# EasyEDA schematic LcsNodes-Extension-Turnout-Servo-and-Relay-B.00.01.json

## Sheets
1 Sheet_1: TITLE: Sheet_1; REV: 1.0; Date: 2023-05-06; Sheet: 1/1; Drawn By: helmut-f; Company: Your Company
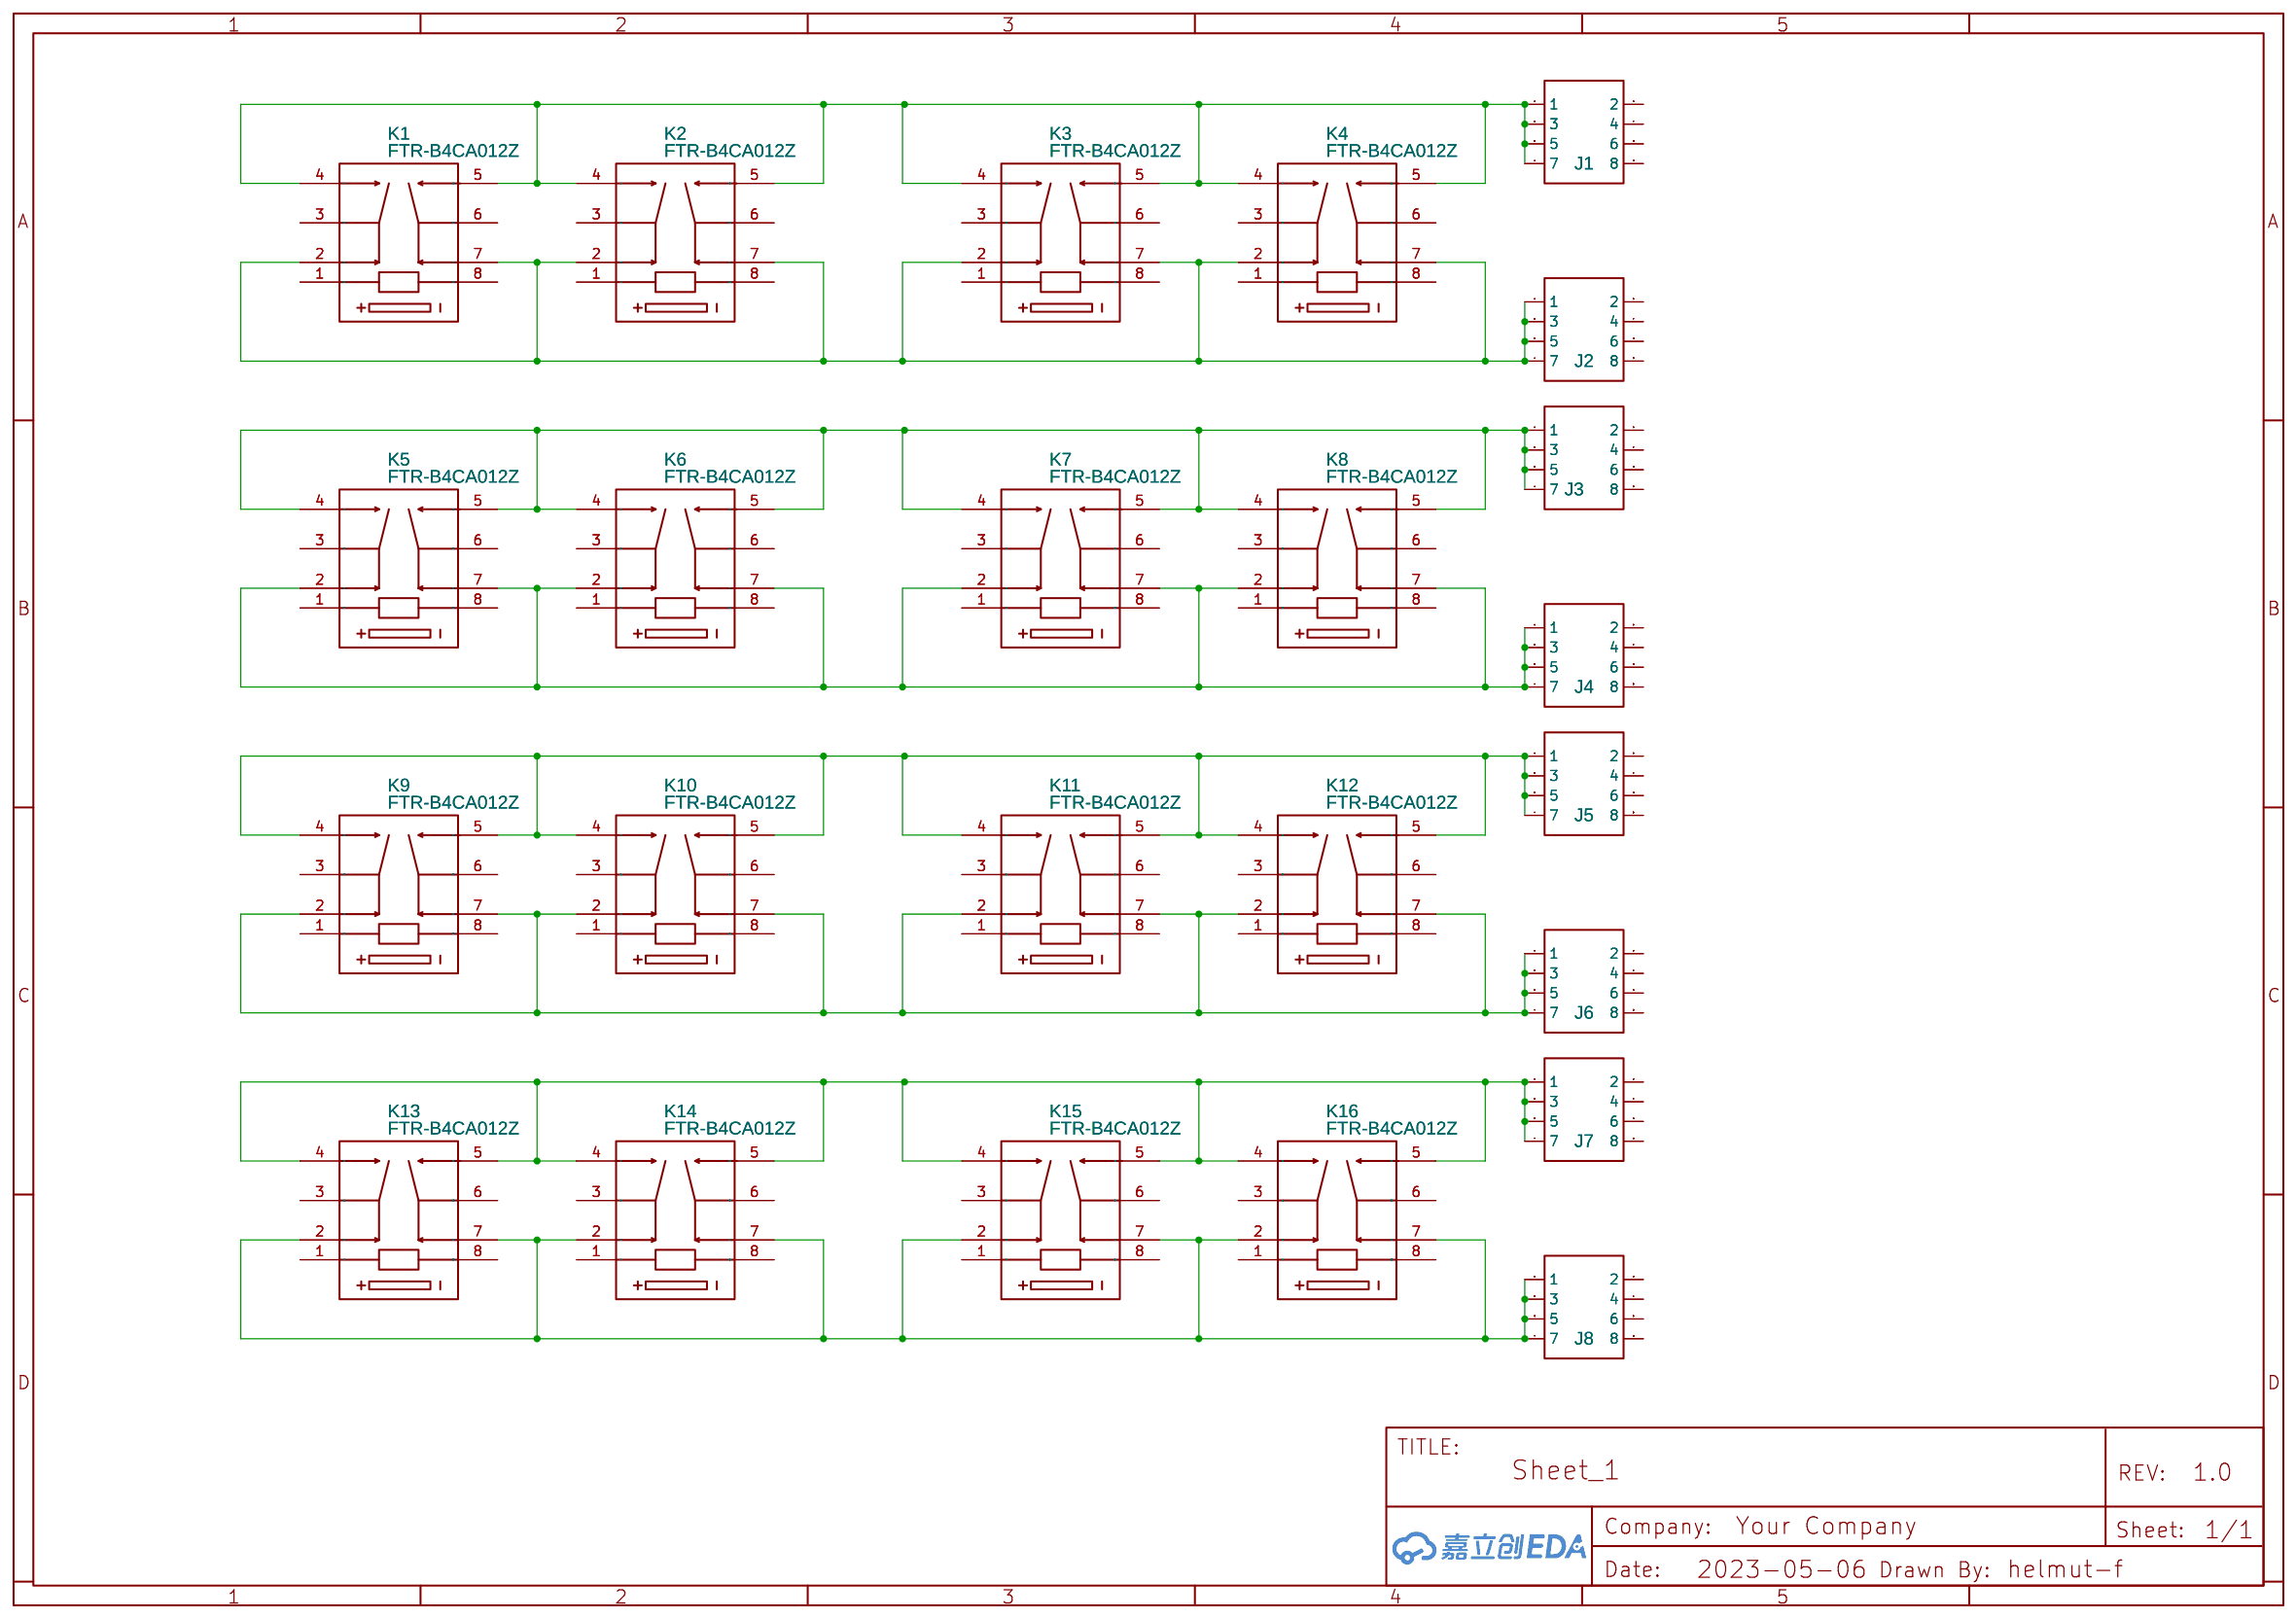
[diagram p0: Sheet_1]
2 Sheet_2: TITLE: Sheet_2
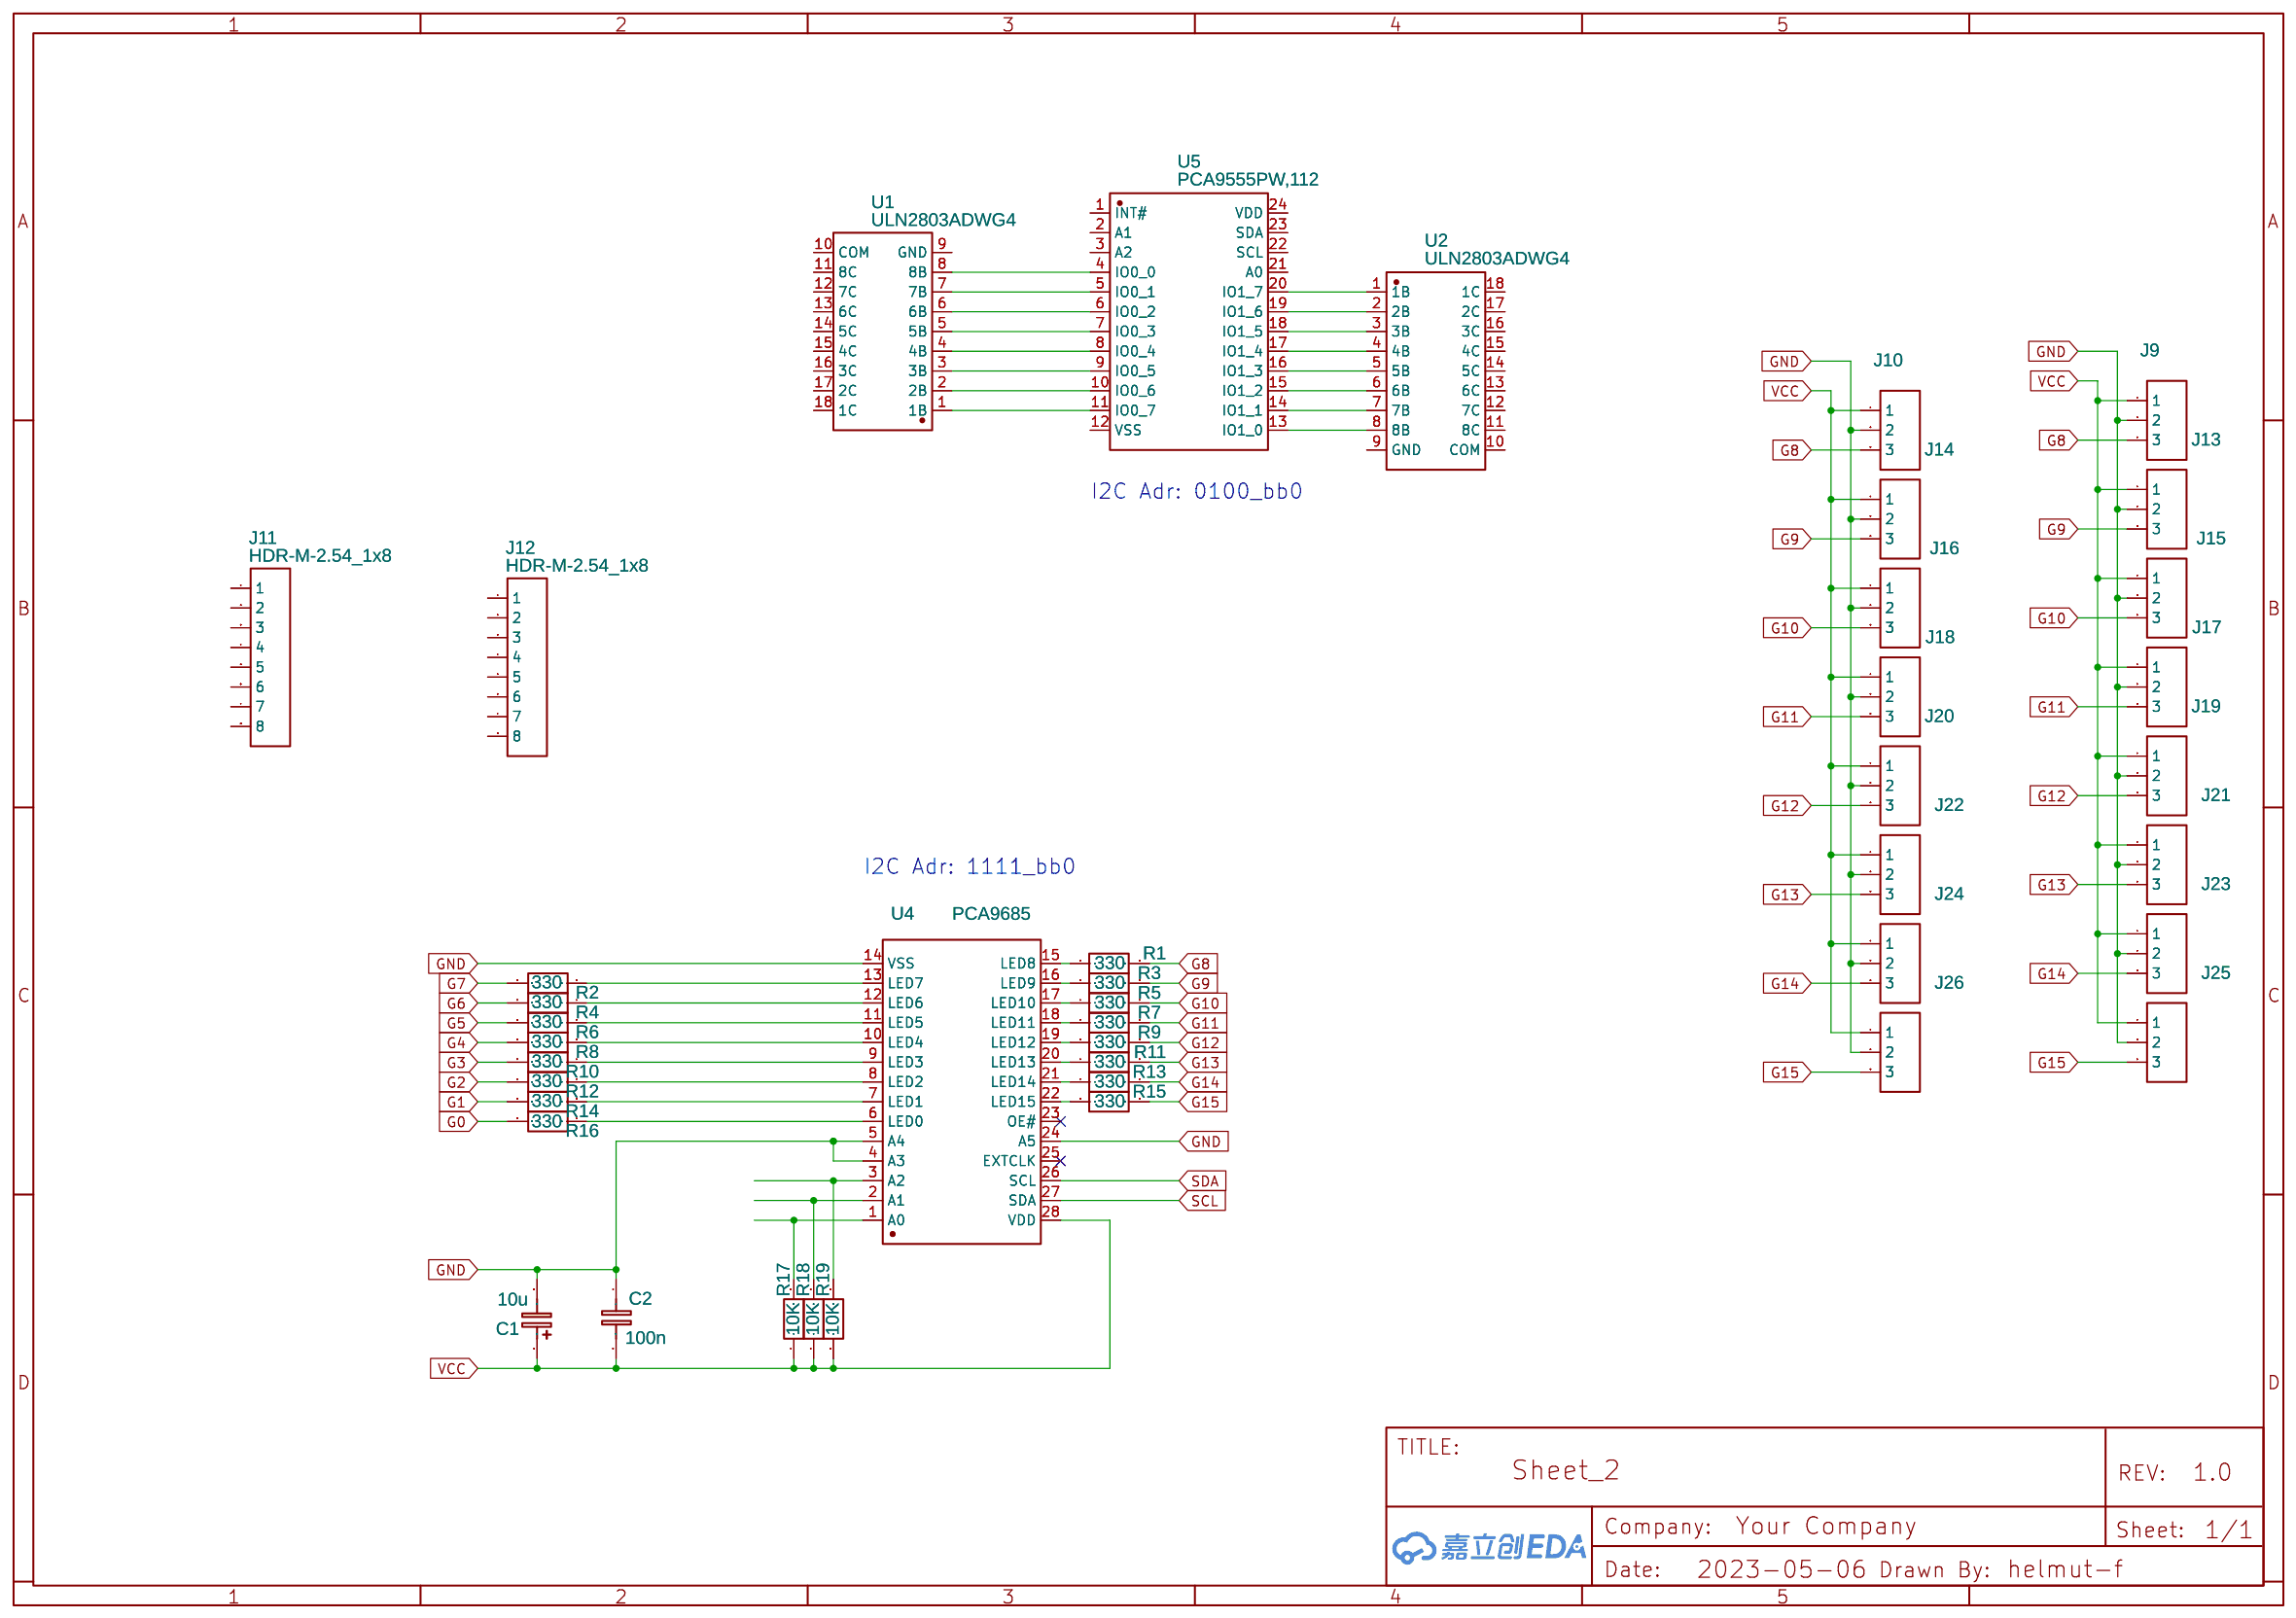
[diagram p1: Sheet_2]
3 Sheet_3: TITLE: Sheet_3; Date: 2023-05-07
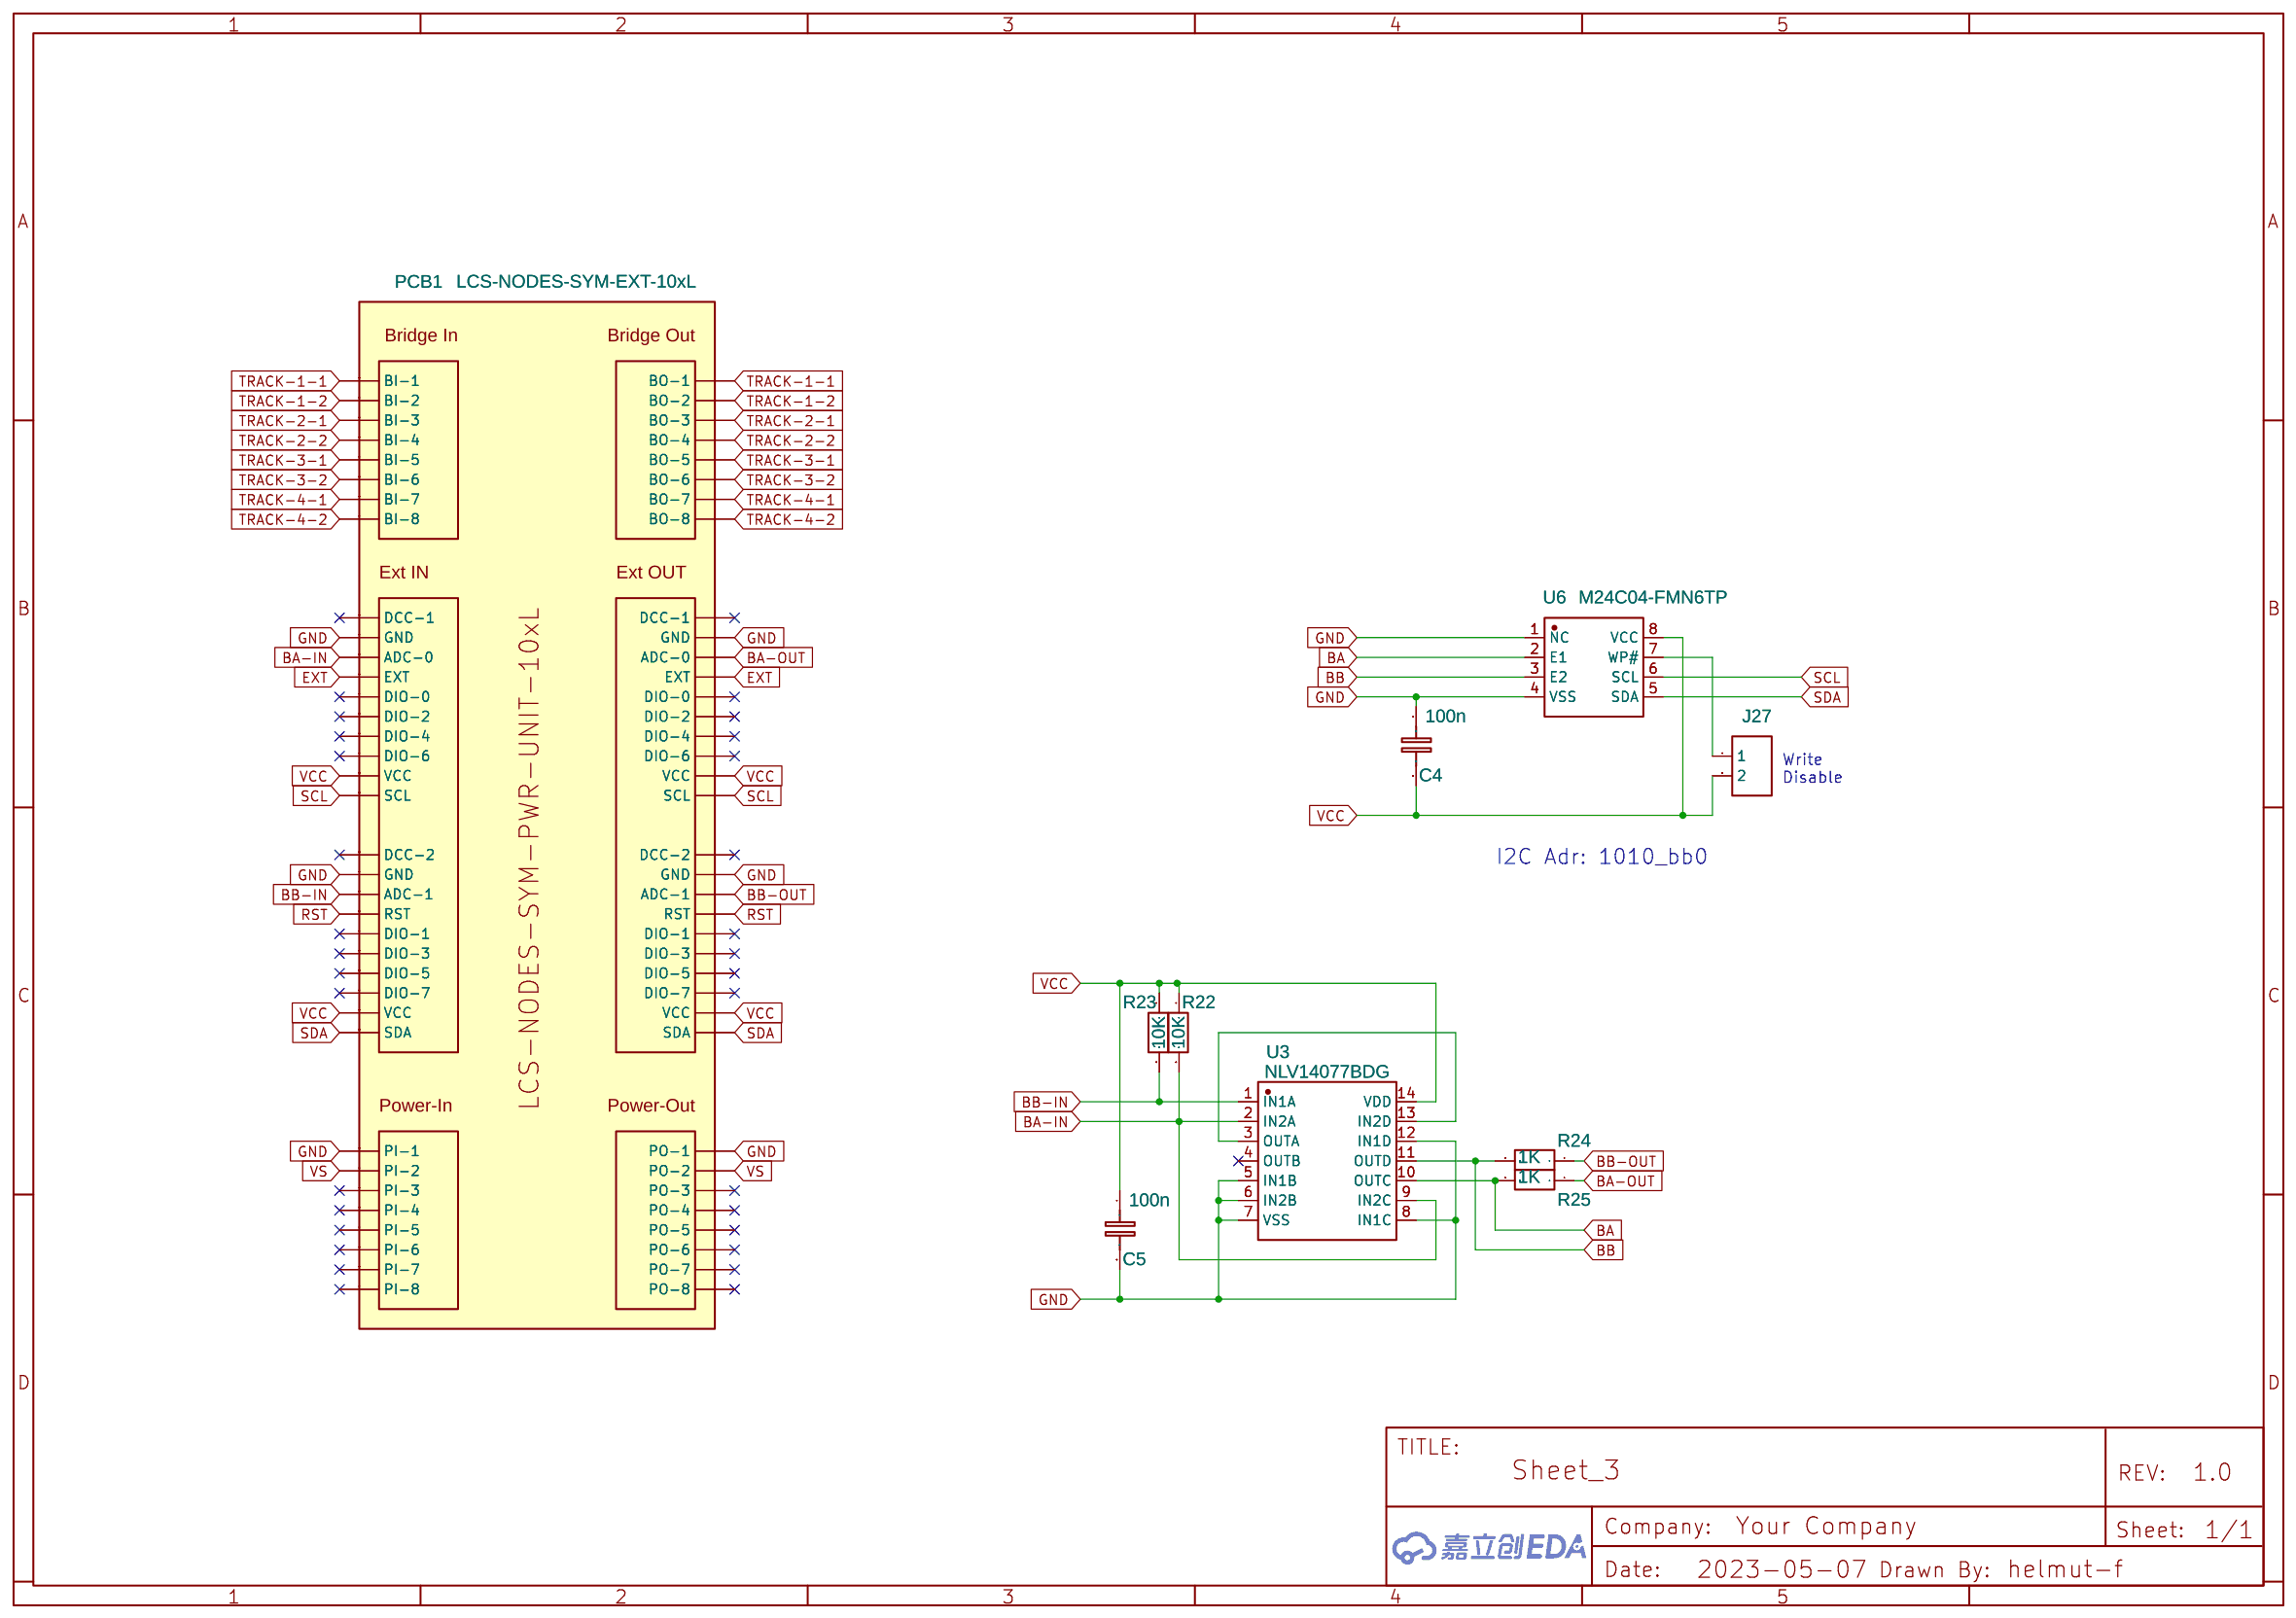
[diagram p2: Sheet_3]

## Parts
sheet Sheet_1
J1  HDR-M-2.54_2x4  [HDR-M-2.54_2X4]
J2  HDR-M-2.54_2x4  [HDR-M-2.54_2X4]
J3  HDR-M-2.54_2x4  [HDR-M-2.54_2X4]
J4  HDR-M-2.54_2x4  [HDR-M-2.54_2X4]
J5  HDR-M-2.54_2x4  [HDR-M-2.54_2X4]
J6  HDR-M-2.54_2x4  [HDR-M-2.54_2X4]
J7  HDR-M-2.54_2x4  [HDR-M-2.54_2X4]
J8  HDR-M-2.54_2x4  [HDR-M-2.54_2X4]
K1  FTR-B4CA012Z  [RELAY-TH_FTR-B4CA012Z]
K2  FTR-B4CA012Z  [RELAY-TH_FTR-B4CA012Z]
K3  FTR-B4CA012Z  [RELAY-TH_FTR-B4CA012Z]
K4  FTR-B4CA012Z  [RELAY-TH_FTR-B4CA012Z]
K5  FTR-B4CA012Z  [RELAY-TH_FTR-B4CA012Z]
K6  FTR-B4CA012Z  [RELAY-TH_FTR-B4CA012Z]
K7  FTR-B4CA012Z  [RELAY-TH_FTR-B4CA012Z]
K8  FTR-B4CA012Z  [RELAY-TH_FTR-B4CA012Z]
K9  FTR-B4CA012Z  [RELAY-TH_FTR-B4CA012Z]
K10  FTR-B4CA012Z  [RELAY-TH_FTR-B4CA012Z]
K11  FTR-B4CA012Z  [RELAY-TH_FTR-B4CA012Z]
K12  FTR-B4CA012Z  [RELAY-TH_FTR-B4CA012Z]
K13  FTR-B4CA012Z  [RELAY-TH_FTR-B4CA012Z]
K14  FTR-B4CA012Z  [RELAY-TH_FTR-B4CA012Z]
K15  FTR-B4CA012Z  [RELAY-TH_FTR-B4CA012Z]
K16  FTR-B4CA012Z  [RELAY-TH_FTR-B4CA012Z]
sheet Sheet_2
C1  10u  [CAP-D4.0×F1.5]
C2  100n  [RAD-0.1]
J9  HDR-M-2.54_1x3  [HDR-M-2.54_1X3]
J10  HDR-M-2.54_1x3  [HDR-M-2.54_1X3]
J11  HDR-M-2.54_1x8  [HDR-M-2.54_1X8]
J12  HDR-M-2.54_1x8  [HDR-M-2.54_1X8]
J13  HDR-M-2.54_1x3  [HDR-M-2.54_1X3]
J14  HDR-M-2.54_1x3  [HDR-M-2.54_1X3]
J15  HDR-M-2.54_1x3  [HDR-M-2.54_1X3]
J16  HDR-M-2.54_1x3  [HDR-M-2.54_1X3]
J17  HDR-M-2.54_1x3  [HDR-M-2.54_1X3]
J18  HDR-M-2.54_1x3  [HDR-M-2.54_1X3]
J19  HDR-M-2.54_1x3  [HDR-M-2.54_1X3]
J20  HDR-M-2.54_1x3  [HDR-M-2.54_1X3]
J21  HDR-M-2.54_1x3  [HDR-M-2.54_1X3]
J22  HDR-M-2.54_1x3  [HDR-M-2.54_1X3]
J23  HDR-M-2.54_1x3  [HDR-M-2.54_1X3]
J24  HDR-M-2.54_1x3  [HDR-M-2.54_1X3]
J25  HDR-M-2.54_1x3  [HDR-M-2.54_1X3]
J26  HDR-M-2.54_1x3  [HDR-M-2.54_1X3]
R1  330  [R1206]
R2  330  [R1206]
R3  330  [R1206]
R4  330  [R1206]
R5  330  [R1206]
R6  330  [R1206]
R7  330  [R1206]
R8  330  [R1206]
R9  330  [R1206]
R10  330  [R1206]
R11  330  [R1206]
R12  330  [R1206]
R13  330  [R1206]
R14  330  [R1206]
R15  330  [R1206]
R16  330  [R1206]
R17  10K  [R1206]
R18  10K  [R1206]
R19  10K  [R1206]
U1  ULN2803ADWG4  [SOIC-18_L11.6-W7.5-P1.27-LS10.3-BL]
U2  ULN2803ADWG4  [SOIC-18_L11.6-W7.5-P1.27-LS10.3-BL]
U4  PCA9685  [TSSOP-28_L9.7-W4.4-P0.65-LS6.4-BL]
U5  PCA9555PW,112  [TSSOP-24_L7.8-W4.4-P0.65-LS6.4-BL]
sheet Sheet_3
C4  100n  [C1206]
C5  100n  [C1206]
J27  HDR-M-2.54_1x2  [HDR-M-2.54_1X2]
PCB1  LCS-NODES-SYM-EXT-10xL  [LCS-NODES-FP-EXT-PCB-10X8]
R22  10K  [R1206]
R23  10K  [R1206]
R24  1K  [R1206]
R25  1K  [R1206]
U3  NLV14077BDG  [SOIC-14_L8.7-W3.9-P1.27-LS6.0-BL]
U6  M24C04-FMN6TP  [SOP-8_L5.0-W3.9-P1.27-LS6.0-BL]

## Library data of the parts
J1-J8 = HDR-M-2.54_2x4: Supplier Part: C58363; Supplier: LCSC; Contributor: LCEDA_Lib
K1-K16 = FTR-B4CA012Z: Supplier: LCSC; Supplier Part: C1222347; Manufacturer: FUJITSU(富士通); Contributor: LCSC; JLCPCB Part Class: Extended Part
C1 = CE_TH_D4.0×F1.5_EU: Contributor: LCEDA_Lib
C2 C4 C5 = C_0603_EU: Contributor: LCEDA_Lib; Package Display: No
J9 J10 J13-J26 = HDR-M-2.54_1x3: Supplier Part: C180248; Supplier: LCSC; Contributor: LCEDA_Lib
J11 J12 = HDR-M-2.54_1x8: Supplier Part: C190820; Supplier: LCSC; Contributor: LCEDA_Lib
R1 R3-R16 R22-R25 = R_AXIAL-0.3_EU: Contributor: LCEDA_Lib
R2 = R_AXIAL-0.3_EU: Contributor: LCEDA_Lib; Package Display: No
R17-R19 = R_1206_EU: Contributor: LCEDA_Lib
U1 U2 = ULN2803ADWG4: Supplier: LCSC; Supplier Part: C4365973; Manufacturer: TI(德州仪器); Contributor: lcsc
U4 = PCA9685PW/Q900,118: Supplier: LCSC; Manufacturer: NXP; Supplier Part: C92206; JLCPCB Part Class: Extended Part; Package Display: No
U5 = PCA9555PW,112: Supplier: LCSC; Supplier Part: C2688893; Manufacturer: NXP(恩智浦); Contributor: LCSC; JLCPCB Part Class: Extended Part
J27 = HDR-M-2.54_1x2: Supplier Part: C124375; Supplier: LCSC; Contributor: LCEDA_Lib
PCB1 = LCS-NODES-SYM-EXT-10xL: Contributor: helmut-f; Package Display: No
U3 = NLV14077BDG: Supplier: LCSC; Supplier Part: C897321; Manufacturer: onsemi(安森美); Contributor: LCSC; JLCPCB Part Class: Extended Part
U6 = M24C04-FMN6TP: Supplier: LCSC; Supplier Part: C2062025; Manufacturer: ST(意法半导体); Contributor: LCSC; JLCPCB Part Class: Extended Part

## Nets
GND: C1.2 C2.1 C4.1 C5.2 J9.2 J10.2 J13.2 J14.2 J15.2 J16.2 J17.2 J18.2 J19.2 J20.2 J21.2 J22.2 J23.2 J24.2 J25.2 J26.2 PCB1.21(GND) PCB1.31(GND) PCB1.40(PI-1) PCB1.61(GND) PCB1.71(GND) PCB1.80(PO-1) U3.5(IN1B) U3.6(IN2B) U3.7(VSS) U3.8(IN1C) U3.12(IN1D) U4.4(A3) U4.5(A4) U4.14(VSS) U4.24(A5) U6.1(NC) U6.4(VSS)
VCC: C1.1 C2.2 C4.2 C5.1 J9.1 J10.1 J13.1 J14.1 J15.1 J16.1 J17.1 J18.1 J19.1 J20.1 J21.1 J22.1 J23.1 J24.1 J25.1 J26.1 J27.2 PCB1.28(VCC) PCB1.38(VCC) PCB1.68(VCC) PCB1.78(VCC) R17.1 R18.1 R19.1 R22.1 R23.1 U3.14(VDD) U4.28(VDD) U6.8(VCC)
BA: R25.2 U3.10(OUTC) U6.2(E1)
BA-IN: PCB1.22(ADC-0) R22.2 U3.2(IN2A) U3.9(IN2C)
BA-OUT: PCB1.62(ADC-0) R25.1
BB: R24.2 U3.11(OUTD) U6.3(E2)
BB-IN: PCB1.32(ADC-1) R23.2 U3.1(IN1A)
BB-OUT: PCB1.72(ADC-1) R24.1
EXT: PCB1.23(EXT) PCB1.63(EXT)
G0: R16.2
G1: R14.2
G2: R12.2
G3: R10.2
G4: R8.2
G5: R6.2
G6: R4.2
G7: R2.2
G8: J9.3 J10.3 R1.2
G9: J13.3 J14.3 R3.2
G10: J15.3 J16.3 R5.2
G11: J17.3 J18.3 R7.2
G12: J19.3 J20.3 R9.2
G13: J21.3 J22.3 R11.2
G14: J23.3 J24.3 R13.2
G15: J25.3 J26.3 R15.2
RST: PCB1.33(RST) PCB1.73(RST)
SCL: PCB1.29(SCL) PCB1.69(SCL) U4.27(SDA) U6.6(SCL)
SDA: PCB1.39(SDA) PCB1.79(SDA) U4.26(SCL) U6.5(SDA)
TRACK-1-1: PCB1.10(BI-1) PCB1.50(BO-1)
TRACK-1-2: PCB1.11(BI-2) PCB1.51(BO-2)
TRACK-2-1: PCB1.12(BI-3) PCB1.52(BO-3)
TRACK-2-2: PCB1.13(BI-4) PCB1.53(BO-4)
TRACK-3-1: PCB1.14(BI-5) PCB1.54(BO-5)
TRACK-3-2: PCB1.15(BI-6) PCB1.55(BO-6)
TRACK-4-1: PCB1.16(BI-7) PCB1.56(BO-7)
TRACK-4-2: PCB1.17(BI-8) PCB1.57(BO-8)
VS: PCB1.41(PI-2) PCB1.81(PO-2)
Net-(J1-1): J1.1 J1.3 J1.5 J1.7 K1.4 K1.5 K2.4 K2.5 K3.4 K3.5 K4.4 K4.5
Net-(J2-1): J2.1 J2.3 J2.5 J2.7 K1.2 K1.7 K2.2 K2.7 K3.2 K3.7 K4.2 K4.7
Net-(J3-1): J3.1 J3.3 J3.5 J3.7 K5.4 K5.5 K6.4 K6.5 K7.4 K7.5 K8.4 K8.5
Net-(J4-1): J4.1 J4.3 J4.5 J4.7 K5.2 K5.7 K6.2 K6.7 K7.2 K7.7 K8.2 K8.7
Net-(J5-1): J5.1 J5.3 J5.5 J5.7 K9.4 K9.5 K10.4 K10.5 K11.4 K11.5 K12.4 K12.5
Net-(J6-1): J6.1 J6.3 J6.5 J6.7 K9.2 K9.7 K10.2 K10.7 K11.2 K11.7 K12.2 K12.7
Net-(J7-1): J7.1 J7.3 J7.5 J7.7 K13.4 K13.5 K14.4 K14.5 K15.4 K15.5 K16.4 K16.5
Net-(J8-1): J8.1 J8.3 J8.5 J8.7 K13.2 K13.7 K14.2 K14.7 K15.2 K15.7 K16.2 K16.7
Net-(J27-1): J27.1 U6.7(WP#)
Net-(R1-1): R1.1 U4.15(LED8)
Net-(R2-1): R2.1 U4.13(LED7)
Net-(R3-1): R3.1 U4.16(LED9)
Net-(R4-1): R4.1 U4.12(LED6)
Net-(R5-1): R5.1 U4.17(LED10)
Net-(R6-1): R6.1 U4.11(LED5)
Net-(R7-1): R7.1 U4.18(LED11)
Net-(R8-1): R8.1 U4.10(LED4)
Net-(R9-1): R9.1 U4.19(LED12)
Net-(R10-1): R10.1 U4.9(LED3)
Net-(R11-1): R11.1 U4.20(LED13)
Net-(R12-1): R12.1 U4.8(LED2)
Net-(R13-1): R13.1 U4.21(LED14)
Net-(R14-1): R14.1 U4.7(LED1)
Net-(R15-1): R15.1 U4.22(LED15)
Net-(R16-1): R16.1 U4.6(LED0)
Net-(R17-2): R17.2 U4.1(A0)
Net-(R18-2): R18.2 U4.2(A1)
Net-(R19-2): R19.2 U4.3(A2)
Net-(U1-1): U1.1(1B) U5.11(IO0_7)
Net-(U1-2): U1.2(2B) U5.10(IO0_6)
Net-(U1-3): U1.3(3B) U5.9(IO0_5)
Net-(U1-4): U1.4(4B) U5.8(IO0_4)
Net-(U1-5): U1.5(5B) U5.7(IO0_3)
Net-(U1-6): U1.6(6B) U5.6(IO0_2)
Net-(U1-7): U1.7(7B) U5.5(IO0_1)
Net-(U1-8): U1.8(8B) U5.4(IO0_0)
Net-(U2-1): U2.1(1B) U5.20(IO1_7)
Net-(U2-2): U2.2(2B) U5.19(IO1_6)
Net-(U2-3): U2.3(3B) U5.18(IO1_5)
Net-(U2-4): U2.4(4B) U5.17(IO1_4)
Net-(U2-5): U2.5(5B) U5.16(IO1_3)
Net-(U2-6): U2.6(6B) U5.15(IO1_2)
Net-(U2-7): U2.7(7B) U5.14(IO1_1)
Net-(U2-8): U2.8(8B) U5.13(IO1_0)
Net-(U3-3): U3.3(OUTA) U3.13(IN2D)

Not connected (* = marked no-connect by the designer): J1 2 4 6 8; J2 2 4 6 8; J3 2 4 6 8; J4 2 4 6 8; J5 2 4 6 8; J6 2 4 6 8; J7 2 4 6 8; J8 2 4 6 8; J11 1 2 3 4 5 6 7 8; J12 1 2 3 4 5 6 7 8; K1 1 3 6 8; K2 1 3 6 8; K3 1 3 6 8; K4 1 3 6 8; K5 1 3 6 8; K6 1 3 6 8; K7 1 3 6 8; K8 1 3 6 8; K9 1 3 6 8; K10 1 3 6 8; K11 1 3 6 8; K12 1 3 6 8; K13 1 3 6 8; K14 1 3 6 8; K15 1 3 6 8; K16 1 3 6 8; PCB1 20(DCC-1)* 24(DIO-0)* 25(DIO-2)* 26(DIO-4)* 27(DIO-6)* 30(DCC-2)* 34(DIO-1)* 35(DIO-3)* 36(DIO-5)* 37(DIO-7)* 42(PI-3)* 43(PI-4)* 44(PI-5)* 45(PI-6)* 46(PI-7)* 47(PI-8)* 60(DCC-1)* 64(DIO-0)* 65(DIO-2)* 66(DIO-4)* 67(DIO-6)* 70(DCC-2)* 74(DIO-1)* 75(DIO-3)* 76(DIO-5)* 77(DIO-7)* 82(PO-3)* 83(PO-4)* 84(PO-5)* 85(PO-6)* 86(PO-7)* 87(PO-8)*; U1 9(GND) 10(COM) 11(8C) 12(7C) 13(6C) 14(5C) 15(4C) 16(3C) 17(2C) 18(1C); U2 9(GND) 10(COM) 11(8C) 12(7C) 13(6C) 14(5C) 15(4C) 16(3C) 17(2C) 18(1C); U3 4(OUTB)*; U4 23(OE#)* 25(EXTCLK)*; U5 1(INT#) 2(A1) 3(A2) 12(VSS) 21(A0) 22(SCL) 23(SDA) 24(VDD)

## Notes on the sheets
sheet 2
- I2C Adr: 0100_bb0
- I2C Adr: 1111_bb0
sheet 3
- Write
  Disable
- I2C Adr: 1010_bb0
